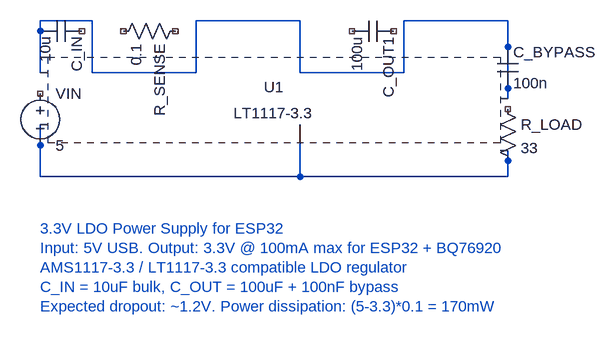
[diagram p0: schematic power_supply_3v3.asc]
power_supply_3v3.asc, the LTspice schematic file:
Version 4
SHEET 1 1600 1000
WIRE 80 160 80 80
WIRE 80 80 160 80
WIRE 160 80 160 160
WIRE 160 160 320 160
WIRE 320 160 320 80
WIRE 320 80 480 80
WIRE 480 80 480 160
WIRE 480 160 640 160
WIRE 640 160 640 80
WIRE 640 80 800 80
WIRE 800 80 800 200
WIRE 80 320 80 240
WIRE 480 320 480 240
WIRE 800 320 800 280
WIRE 80 320 480 320
WIRE 480 320 800 320
SYMBOL voltage 80 176 R0
SYMATTR InstName VIN
SYMATTR Value 5
SYMBOL cap 144 80 R90
SYMATTR InstName C_IN
SYMATTR Value 10u
SYMATTR SpiceLine V=5
SYMBOL res 304 80 R90
SYMATTR InstName R_SENSE
SYMATTR Value 0.1
SYMBOL LT1117-3.3 480 160 R0
SYMATTR InstName U1
SYMBOL cap 624 80 R90
SYMATTR InstName C_OUT1
SYMATTR Value 100u
SYMATTR SpiceLine V=3.3
SYMBOL cap 784 120 R0
SYMATTR InstName C_BYPASS
SYMATTR Value 100n
SYMBOL res 784 200 R0
SYMATTR InstName R_LOAD
SYMATTR Value 33
TEXT 80 400 Left 2 ;3.3V LDO Power Supply for ESP32
TEXT 80 430 Left 2 ;Input: 5V USB. Output: 3.3V @ 100mA max for ESP32 + BQ76920
TEXT 80 460 Left 2 ;AMS1117-3.3 / LT1117-3.3 compatible LDO regulator
TEXT 80 490 Left 2 ;C_IN = 10uF bulk, C_OUT = 100uF + 100nF bypass
TEXT 80 520 Left 2 ;Expected dropout: ~1.2V. Power dissipation: (5-3.3)*0.1 = 170mW
.tran 0 5m 0 1u
.meas TRAN Vout_avg AVG V(n003) FROM 1m TO 5m
.meas TRAN Vout_ripple PP V(n003) FROM 4m TO 5m
.backanno
.end

The netlist it stands for:
* power_supply_3v3.asc
VIN NC_01 N002 5
C_IN NC_02 N001 10u V=5
R_SENSE NC_03 NC_04 0.1
* U1: LT1117-3.3 (symbol LT1117-3.3 not available, pin order unknown); nets seen at it: N001, N002
C_OUT1 NC_05 NC_06 100u V=3.3
C_BYPASS N001 N001 100n
R_LOAD NC_07 N002 33
* 3.3V LDO Power Supply for ESP32
* Input: 5V USB. Output: 3.3V @ 100mA max for ESP32 + BQ76920
* AMS1117-3.3 / LT1117-3.3 compatible LDO regulator
* C_IN = 10uF bulk, C_OUT = 100uF + 100nF bypass
* Expected dropout: ~1.2V. Power dissipation: (5-3.3)*0.1 = 170mW
.backanno
.end